# Altium schematic sheet main.SchDoc
size A4; SheetNumber: 1; SheetTotal: 2
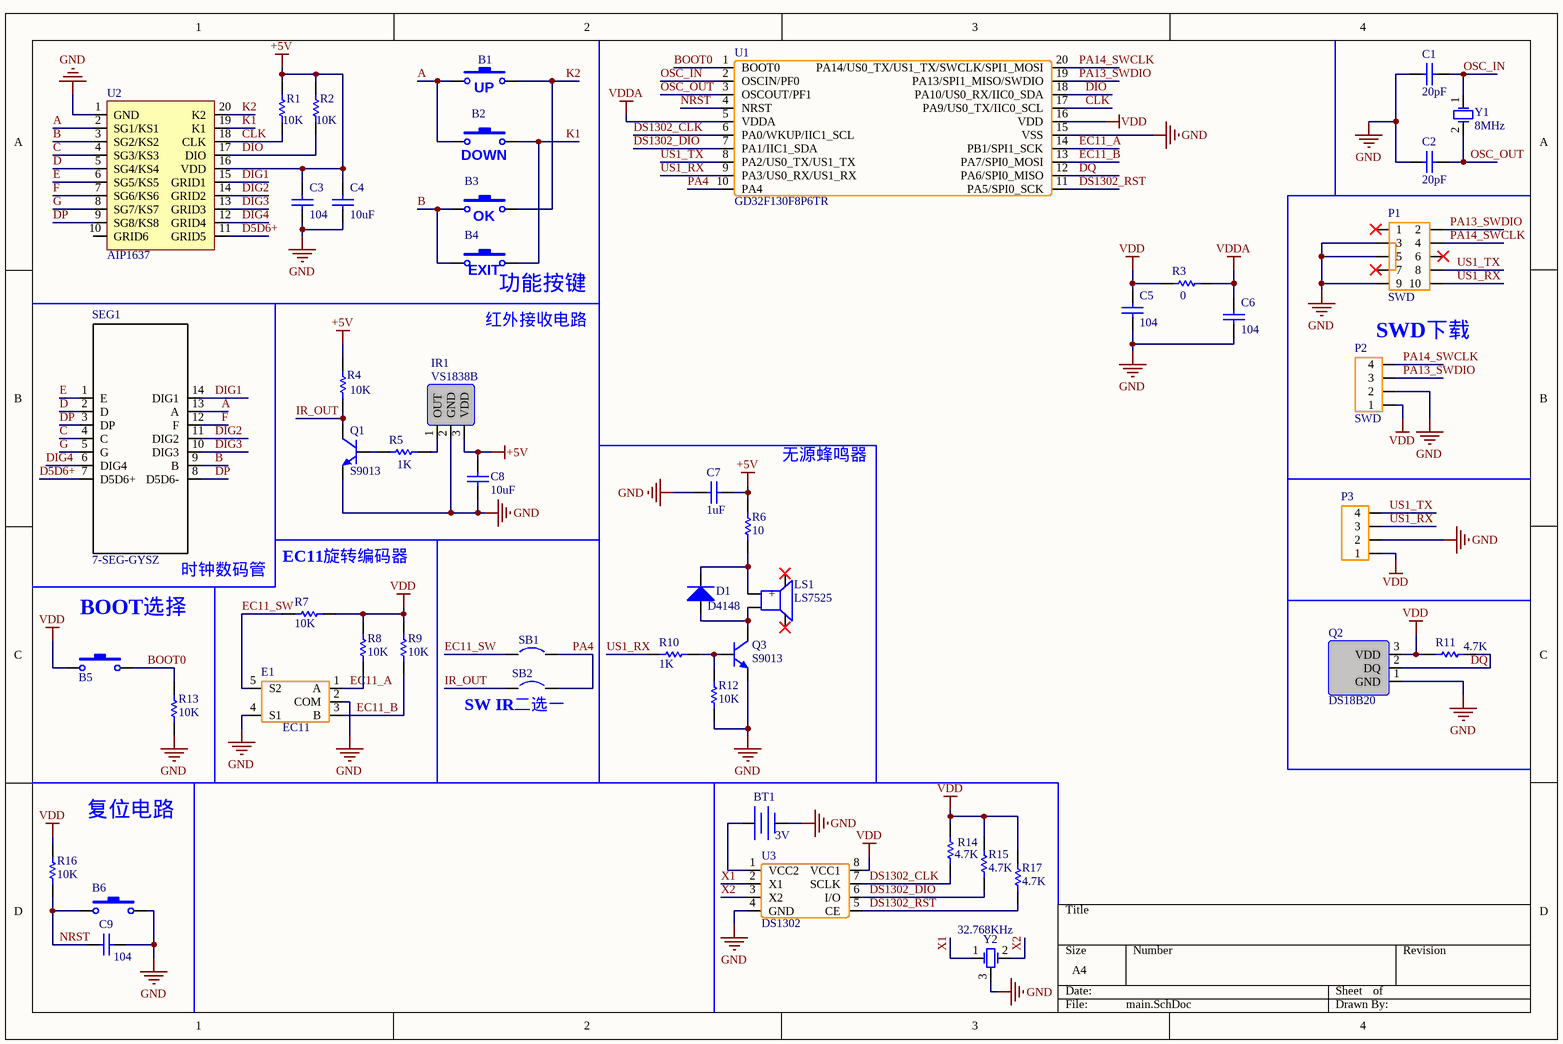
[diagram p0: main.SchDoc]

## Parts
B1  用户按钮  [SW-SMD_L6.0-W3.5-LS8.0]  (value not drawn)
B2  用户按钮  [SW-SMD_L6.0-W3.5-LS8.0]  (value not drawn)
B3  用户按钮  [SW-SMD_L6.0-W3.5-LS8.0]  (value not drawn)
B4  用户按钮  [SW-SMD_L6.0-W3.5-LS8.0]  (value not drawn)
B5  复位按钮  [SW-SMD_L6.0-W3.5-LS8.0]  (value not drawn)
B6  复位按钮  [SW-SMD_L6.0-W3.5-LS8.0]  (value not drawn)
BT1  3V  [BAT-SMD_CR1220-2]
C1  value 20pF  [C0603]  (hidden comment: Cap)
C2  value 20pF  [C0603]  (hidden comment: Cap)
C3  value 104  [C0603]  (hidden comment: Cap)
C4  value 10uF  [C1812]  (hidden comment: Cap)
C5  value 104  [C0603]  (hidden comment: Cap)
C6  value 104  [C0603]  (hidden comment: Cap)
C7  value 1uF  [C1206]  (hidden comment: Cap)
C8  value 10uF  [C1210]  (hidden comment: Cap)
C9  value 104  [C0603]  (hidden comment: Cap)
D1  D4148  [SOD-80_L3.5-W1.5-RD]
E1  EC11  [EC11]
IR1  VS1838B  [HS0038]
LS1  LS7525  [BUZ-SMD_4P-7525]
P1  SWD  [IDC-SMD-10P-1.27MM]
P2  SWD  [HDR1X4-Male]
P3  HDR-M-2.54-1x4  [HDR1X4-Male]  (value not drawn)
Q1  S9013  [SOT-23-3_L2.9-W1.6-P1.90-LS2.8-BR]
Q2  DS18B20  [TO-92A]
Q3  S9013  [SOT-23-3_L2.9-W1.6-P1.90-LS2.8-BR]
R1  value 10K  [R0603]  (hidden comment: Res)
R2  value 10K  [R0603]  (hidden comment: Res)
R3  value 0  [R0603]  (hidden comment: Res)
R4  value 10K  [R0603]  (hidden comment: Res)
R5  value 1K  [R0603]  (hidden comment: Res)
R6  value 10  [R0603]  (hidden comment: Res)
R7  value 10K  [R0603]  (hidden comment: Res)
R8  value 10K  [R0603]  (hidden comment: Res)
R9  value 10K  [R0603]  (hidden comment: Res)
R10  value 1K  [R0603]  (hidden comment: Res)
R11  value 4.7K  [R0603]  (hidden comment: Res)
R12  value 10K  [R0603]  (hidden comment: Res)
R13  value 10K  [R0603]  (hidden comment: Res)
R14  value 4.7K  [R0603]  (hidden comment: Res)
R15  value 4.7K  [R0603]  (hidden comment: Res)
R16  value 10K  [R0603]  (hidden comment: Res)
R17  value 4.7K  [R0603]  (hidden comment: Res)
SB1  Circuit Breaker  [JP2_SMD]  (value not drawn)
SB2  Circuit Breaker  [JP2_SMD]  (value not drawn)
SEG1  7-SEG-GYSZ  [7-SEG-GY0_8INCH]
U1  GD32F130F8P6TR  [TSSOP-20-N]
U2  AIP1637  [SOP-20_L12.8-W7.5-P1.27-LS10.4-BL]
U3  DS1302  [SOIC-8_208mil_L5.3-W5.3-P1.27-LS8.0-BL]
Y1  8MHz  [HC-49]
Y2  32.768KHz  [CRYSTAL-SMD_BD2.0-L6.0-P2.54-32.768]

## Nets
+5V: C3.2 C4.2 C7.1 C8.1 IR1.3(VDD) R1.2 R2.2 R4.1 R6.2 U2.16(VDD)
GND: B6.2 BT1.2(-) C1.1 C2.1 C3.1 C4.1 C5.1 C6.1 C7.2 C8.2 C9.2 E1.2(COM) E1.4(S1) IR1.2(GND) P1.3 P1.5 P1.9 P2.2 P3.2 Q1.2(E) Q2.1(GND) Q3.2(E) R12.2 R13.1 U1.15(VSS) U2.1(GND) U3.4(GND) Y2.3(GND)
VDD: B5.1 C5.2 P2.1 P3.1 Q2.3(VDD) R3.2 R7.1 R8.2 R9.2 R11.2 R14.1 R15.1 R16.2 R17.1 U1.16(VDD) U3.8(VCC1)
VDDA: C6.2 R3.1 U1.5(VDDA)
A: B1.1 B2.1 SEG1.13(A) U2.2(SG1/KS1)
B: B3.1 B4.1 SEG1.9(B) U2.3(SG2/KS2)
BOOT0: B5.2 R13.2 U1.1(BOOT0)
C: SEG1.4(C) U2.4(SG3/KS3)
CLK: R1.1 U1.17(PA9/US0_TX/IIC0_SCL) U2.18(CLK)
D: SEG1.2(D) U2.5(SG4/KS4)
D5D6+: SEG1.7(D5D6+) U2.11(GRID5)
DIG1: SEG1.14(DIG1) U2.15(GRID1)
DIG2: SEG1.11(DIG2) U2.14(GRID2)
DIG3: SEG1.10(DIG3) U2.13(GRID3)
DIG4: SEG1.6(DIG4) U2.12(GRID4)
DIO: R2.1 U1.18(PA10/US0_RX/IIC0_SDA) U2.17(DIO)
DP: SEG1.3(DP) SEG1.8(D5D6-) U2.9(SG8/KS8)
DQ: Q2.2(DQ) R11.1 U1.12(PA6/SPI0_MISO)
DS1302_CLK: R14.2 U1.6(PA0/WKUP/IIC1_SCL) U3.7(SCLK)
DS1302_DIO: R15.2 U1.7(PA1/IIC1_SDA) U3.6(I/O)
DS1302_RST: R17.2 U1.11(PA5/SPI0_SCK) U3.5(CE)
E: SEG1.1(E) U2.6(SG5/KS5)
EC11_A: E1.1(A) R8.1 U1.14(PB1/SPI1_SCK)
EC11_B: E1.3(B) R9.1 U1.13(PA7/SPI0_MOSI)
EC11_SW: E1.5(S2) R7.2 SB1.1
F: SEG1.12(F) U2.7(SG6/KS6)
G: SEG1.5(G) U2.8(SG7/KS7)
IR_OUT: Q1.3(C) R4.2 SB2.1
K1: B2.2 B4.2 U2.19(K1)
K2: B1.2 B3.2 U2.20(K2)
NRST: B6.1 C9.1 R16.1 U1.4(NRST)
OSC_IN: C1.2 U1.2(OSCIN/PF0) Y1.1(OSC1)
OSC_OUT: C2.2 U1.3(OSCOUT/PF1) Y1.2(OSC2)
PA4: SB1.2 SB2.2 U1.10(PA4)
PA13_SWDIO: P1.2 P2.3 U1.19(PA13/SPI1_MISO/SWDIO)
PA14_SWCLK: P1.4 P2.4 U1.20(PA14/US0_TX/US1_TX/SWCLK/SPI1_MOSI)
US1_RX: P1.10 P3.3 R10.2 U1.9(PA3/US0_RX/US1_RX)
US1_TX: P1.8 P3.4 U1.8(PA2/US0_TX/US1_TX)
X1: U3.2(X1) Y2.1(OSC1)
X2: U3.3(X2) Y2.2(OSC2)
NetBT1_1: BT1.1(+) U3.1(VCC2)
NetD1_1: D1.1(K) LS1.1(+) R6.1
NetD1_2: D1.2(A) LS1.2(-) Q3.3(C)
NetIR1_1: IR1.1(OUT) R5.1
NetQ1_1: Q1.1(B) R5.2
NetQ3_1: Q3.1(B) R10.1 R12.1

Not connected (* = marked no-connect by the designer): LS1 3* 4*; P1 1* 6* 7*; U2 10(GRID6)

## Notes on the sheet
- (near B1) UP
- (near B2) DOWN
- (near B3) OK
- (near B4) EXIT
- (near B4) 功能按键
- (near B4) 红外接收电路
- (near P2) SWD下载
- 无源蜂鸣器
- 时钟数码管
- EC11旋转编码器
- (near B5) BOOT选择
- (near SB2) SW IR二选一
- (near R16) 复位电路

## Library data of the parts
B1-B6 = Button: 轻触按钮 - Switch; Published: 24-Mar-1999; LatestRevisionDate: 17-Jul-2002; LatestRevisionNote: Re-released for DXP Platform.; PackageReference: SPST-2; Publisher: Altium Limited; PackageDescription: Switch; 2 Leads
BT1 = Battery: 电池
C1-C9 = Cap: 无极性电容; Publisher: 信念D力量
D1 = D4148: 4148二极管
E1 = EC11: EC11 旋转编码器，一圈20个脉冲
IR1 = VS1838B: 红外接收管
LS1 = LS7525: 扬声器 - Loudspeaker; Published: 24-Mar-1999; LatestRevisionDate: 17-Jul-2002; LatestRevisionNote: Re-released for DXP Platform.; PackageReference: PIN2; Publisher: Altium Limited
P1 = IDC-2x5: 牛角座
P2 P3 = HDR-M-2.54-1x4: 排针，2.54MM
Q1 Q3 = S9013: NPN 三极管; ComponentLink1Description: Manufacturer Link; ComponentLink2Description: Datasheet
Q2 = DS18B20: 温度传感器
R1-R17 = Res: 美国电阻符号; Published: 8-Jun-2000; LatestRevisionDate: 29-May-2009; LatestRevisionNote: IPC-7351 Footprint Added.; PackageReference: J1-0603; Publisher: Altium Limited; PackageDescription: Chip Resistor
SB1 SB2 = Circuit Breaker: 断路器 短路选择 - Circuit Breaker; Solder: NO; Published: 24-Mar-1999; Revision: July-2002: Re-released for DXP Platform.; Publisher: Altium Limited
SEG1 = 7-SEG-GYSZ: 4位共阳极数码管 带时钟显示
U1 = GD32F130F8P6TR: GD32单片机 RAM 8KB Flash 64KB
U2 = AIP1637: 数码管驱动
U3 = DS1302: 时钟芯片
Y1 = XTAL: 晶振 - Crystal Oscillator; Published: 8-Jun-2000; LatestRevisionDate: 17-Jul-2002; LatestRevisionNote: Re-released for DXP Platform.; PackageReference: R38; Publisher: Altium Limited; PackageDescription: Crystal, Thru-Hole; 2 Leads; Body 3.1 x 8.2 mm (Dia.xH)
Y2 = XTAL-3: 晶振 - Crystal Oscillator; Published: 8-Jun-2000; LatestRevisionDate: 17-Jul-2002; LatestRevisionNote: Re-released for DXP Platform.; PackageReference: R38; Publisher: Altium Limited; PackageDescription: Crystal, Thru-Hole; 2 Leads; Body 3.1 x 8.2 mm (Dia.xH)